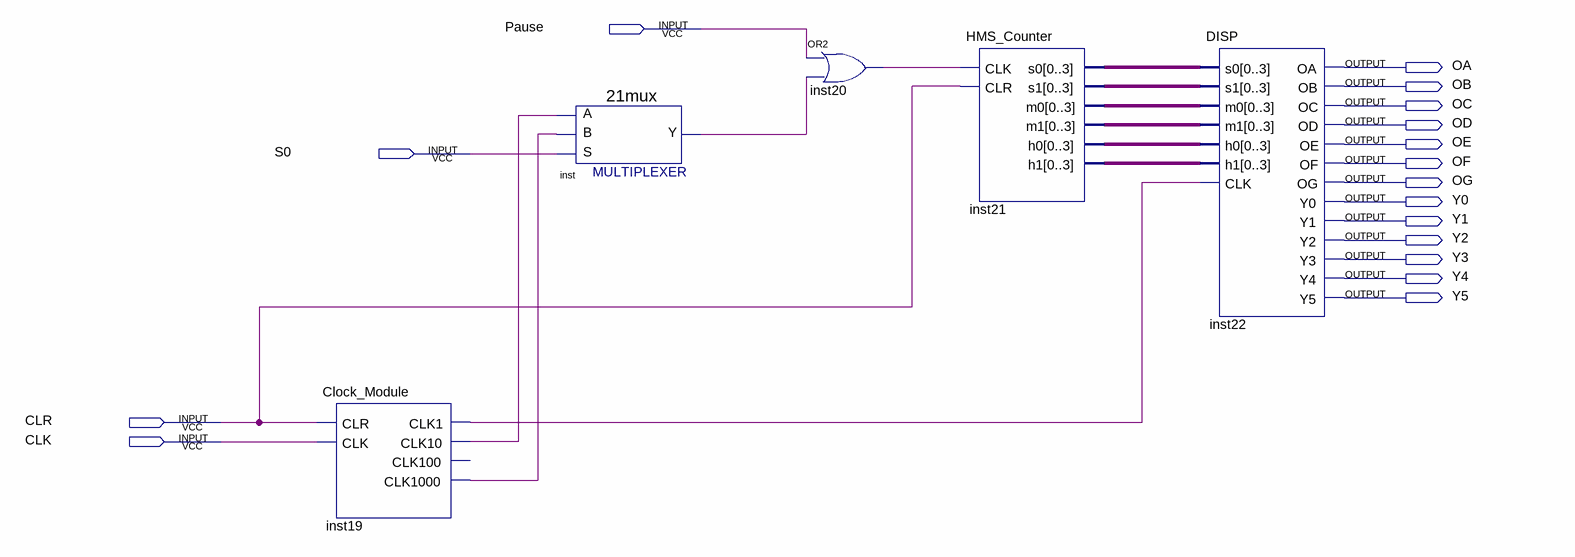
[diagram p0: schematic sheet]
// Quartus schematic 20210530_Clock.bdf as structural Verilog: 5 symbols, 17 pins
module \20210530_Clock  (
  input  Pause,
  input  S0,
  input  CLR,
  input  CLK,
  output OA,
  output OB,
  output OC,
  output OD,
  output OE,
  output OF,
  output OG,
  output Y0,
  output Y1,
  output Y2,
  output Y3,
  output Y4,
  output Y5
);

  wire inst19_clk1, inst19_clk10, inst19_clk1000, inst20_out, inst_y;
  wire [3:0] inst21_h0, inst21_h1, inst21_m0, inst21_m1, inst21_s0, inst21_s1;

  Clock_Module inst19 (
    .CLR(CLR), .CLK(CLK), .CLK1(inst19_clk1), .CLK10(inst19_clk10), .CLK1000(inst19_clk1000));  // open: CLK100
  \21mux  inst (.S(S0), .B(inst19_clk1000), .A(inst19_clk10), .Y(inst_y));
  or inst20 (inst20_out, Pause, inst_y);
  HMS_Counter inst21 (
    .CLK(inst20_out), .CLR(CLR), .s0(inst21_s0), .s1(inst21_s1), .m0(inst21_m0), .m1(inst21_m1),
    .h0(inst21_h0), .h1(inst21_h1));
  DISP inst22 (
    .s0(inst21_s0), .s1(inst21_s1), .m0(inst21_m0), .m1(inst21_m1), .h0(inst21_h0), .h1(inst21_h1),
    .CLK(inst19_clk1), .OA(OA), .OB(OB), .OC(OC), .OD(OD), .OE(OE), .OF(OF), .OG(OG), .Y0(Y0), .Y1(Y1),
    .Y2(Y2), .Y3(Y3), .Y4(Y4), .Y5(Y5));
endmodule
